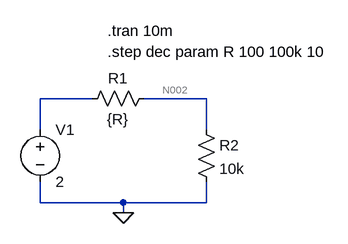
[diagram p0: schematic CL1_T1_OutputResistance.asc]
CL1_T1_OutputResistance.asc, the LTspice schematic file:
Version 4.1
SHEET 1 880 680
WIRE 144 80 64 80
WIRE 320 80 224 80
WIRE 64 128 64 80
WIRE 320 128 320 80
WIRE 64 240 64 208
WIRE 192 240 64 240
WIRE 320 240 320 208
WIRE 320 240 192 240
WIRE 192 256 192 240
FLAG 192 256 0
SYMBOL voltage 64 112 R0
WINDOW 123 0 0 Left 0
WINDOW 39 0 0 Left 0
SYMATTR InstName V1
SYMATTR Value 2
SYMBOL res 304 112 R0
SYMATTR InstName R2
SYMATTR Value 10k
SYMBOL res 240 64 R90
WINDOW 0 0 56 VBottom 2
WINDOW 3 32 56 VTop 2
SYMATTR InstName R1
SYMATTR Value {R}
TEXT 168 8 Left 2 !.step dec param R 100 100k 10
TEXT 168 -24 Left 2 !.tran 10m

The netlist it stands for:
* CL1_T1_OutputResistance.asc
V1 N001 0 2
R2 N002 0 10k
R1 N002 N001 {R}
.step dec param R 100 100k 10
.tran 10m
.backanno
.end

* Results of the author's LTspice run, read from the files saved beside the schematic
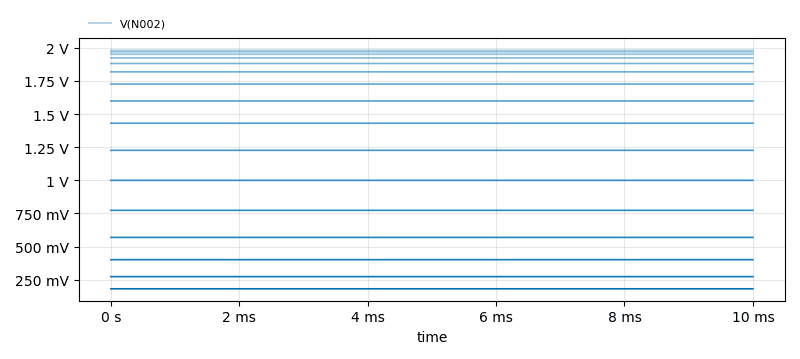
[diagram p1: Transient Analysis of CL1_T1_OutputResistance.asc, plotted from the saved traces]
* Transient Analysis, 31 runs:
*   V(N002) [run 1]: min 1.98 V, max 1.98 V, average 1.98 V, rms 1.98 V, last 1.98 V
*   V(N002) [run 2]: min 1.969 V, max 1.969 V, average 1.969 V, rms 1.969 V, last 1.969 V
*   V(N002) [run 3]: min 1.951 V, max 1.951 V, average 1.951 V, rms 1.951 V, last 1.951 V
*   V(N002) [run 4]: min 1.923 V, max 1.923 V, average 1.923 V, rms 1.923 V, last 1.923 V
*   V(N002) [run 5]: min 1.881 V, max 1.881 V, average 1.881 V, rms 1.881 V, last 1.881 V
*   V(N002) [run 6]: min 1.818 V, max 1.818 V, average 1.818 V, rms 1.818 V, last 1.818 V
*   V(N002) [run 7]: min 1.726 V, max 1.726 V, average 1.726 V, rms 1.726 V, last 1.726 V
*   V(N002) [run 8]: min 1.598 V, max 1.598 V, average 1.598 V, rms 1.598 V, last 1.598 V